# EAGLE schematic schematic (EAGLE 9.5.2)
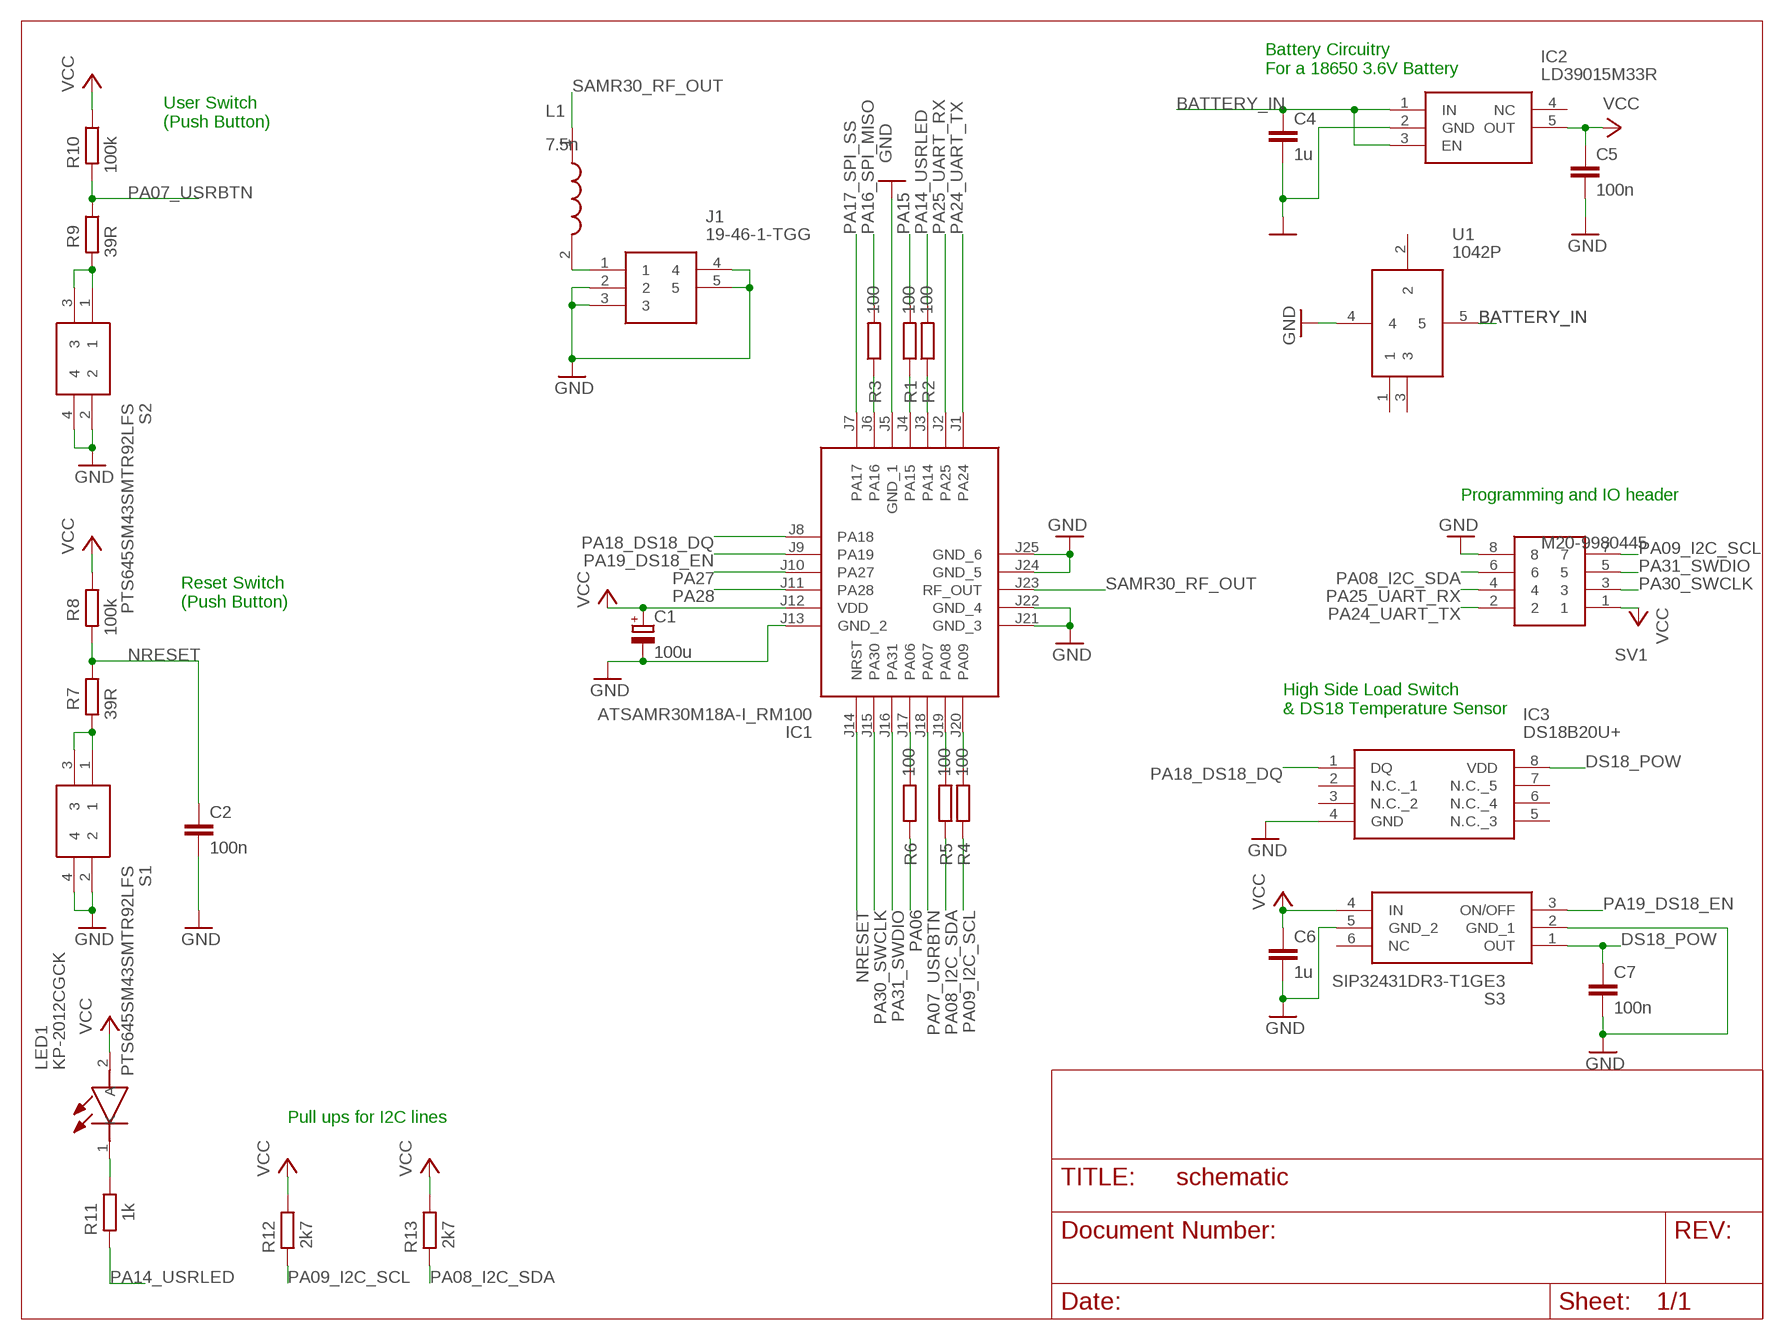
[diagram p0: schematic, sheet 1]

## Parts
C1  100u  CPOL-EUA/3216-18W  [A/3216-18W]
C2  100n  C-EUC0805  [C0805]
C4  1u  C-EUC0805  [C0805]
C5  100n  C-EUC0805  [C0805]
C6  1u  C-EUC0805  [C0805]
C7  100n  C-EUC0805  [C0805]
IC1  ATSAMR30M18A-I_RM100  [ATSAMR30M18AIRM100]
IC2  LD39015M33R  [SOT95P280X145-5N]
IC3  DS18B20U+  [SOP65P490X110-8N]
J1  19-46-1-TGG  [19-46-1-TGG_1]
L1  7.5n  MHQ1005P10NJT  [INDC1006X60N]
LED1  KP-2012CGCK  [LEDC2012X110N]
R1  100  R-EU_R0603  [R0603]
R2  100  R-EU_R0603  [R0603]
R3  100  R-EU_R0603  [R0603]
R4  100  R-EU_R0603  [R0603]
R5  100  R-EU_R0603  [R0603]
R6  100  R-EU_R0603  [R0603]
R7  39R  R-EU_R0603  [R0603]
R8  100k  R-EU_R0603  [R0603]
R9  39R  R-EU_R0603  [R0603]
R10  100k  R-EU_R0603  [R0603]
R11  1k  R-EU_R0603  [R0603]
R12  2k7  R-EU_R0603  [R0603]
R13  2k7  R-EU_R0603  [R0603]
S1  PTS645SM43SMTR92LFS  [PTS645(SMT)]
S2  PTS645SM43SMTR92LFS  [PTS645(SMT)]
S3  SIP32431DR3-T1GE3  [SOT65P210X110-6N]
SV1  M20-9980445  [HDRV8W64P254_2X4_1016X508X868P]
U1  1042P  [1042P]

## Nets
BATTERY_IN: C4.1 IC2.1(IN) IC2.3(EN) U1.5
DS18_POW: C7.1 IC3.8(VDD) S3.1(OUT)
GND: C1.- C2.2 C4.2 C5.2 C6.2 C7.2 IC1.J5(GND_1) IC1.J13(GND_2) IC1.J21(GND_3) IC1.J22(GND_4) IC1.J24(GND_5) IC1.J25(GND_6) IC2.2(GND) IC3.4(GND) J1.2 J1.3 J1.4 J1.5 S1.2 S1.4 S2.2 S2.4 S3.2(GND_1) S3.5(GND_2) SV1.8 U1.4
N$1: R9.2 S2.1 S2.3
N$2: IC1.J4(PA15) R1.1
N$3: IC1.J6(PA16) R3.1
N$4: IC1.J3(PA14) R2.1
N$5: IC1.J17(PA06) R6.2
N$6: IC1.J19(PA08) R5.2
N$7: IC1.J20(PA09) R4.2
N$8: R7.2 S1.1 S1.3
N$9: LED1.1(K) R11.1
N$10: J1.1 L1.2
NRESET: C2.1 IC1.J14(NRST) R7.1 R8.2
PA06: R6.1
PA07_USRBTN: IC1.J18(PA07) R9.1 R10.2
PA08_I2C_SDA: R5.1 R13.2 SV1.6
PA09_I2C_SCL: R4.1 R12.2 SV1.7
PA14_USRLED: R2.2 R11.2
PA15: R1.2
PA16_SPI_MISO: R3.2
PA17_SPI_SS: IC1.J7(PA17)
PA18_DS18_DQ: IC1.J8(PA18) IC3.1(DQ)
PA19_DS18_EN: IC1.J9(PA19) S3.3(ON/OFF)
PA24_UART_TX: IC1.J1(PA24) SV1.2
PA25_UART_RX: IC1.J2(PA25) SV1.4
PA27: IC1.J10(PA27)
PA28: IC1.J11(PA28)
PA30_SWCLK: IC1.J15(PA30) SV1.3
PA31_SWDIO: IC1.J16(PA31) SV1.5
SAMR30_RF_OUT: IC1.J23(RF_OUT) L1.1
VCC: C1.+ C5.1 C6.1 IC1.J12(VDD) IC2.5(OUT) LED1.2(A) R8.1 R10.1 R12.1 R13.1 S3.4(IN) SV1.1
Unconnected: IC2.4(NC) IC3.2(N.C._1) IC3.3(N.C._2) IC3.5(N.C._3) IC3.6(N.C._4) IC3.7(N.C._5) S3.6(NC) U1.1 U1.2 U1.3

## Notes on the sheet
- Battery Circuitry
  For a 18650 3.6V Battery
- User Switch
  (Push Button)
- Programming and IO header
- Reset Switch 
  (Push Button)
- High Side Load Switch
  & DS18 Temperature Sensor
- Pull ups for I2C lines

## Library data of the parts
C1 = rcl:CPOL-EU: POLARIZED CAPACITOR, European symbol; SPICEPREFIX: C
C2 C4-C7 = rcl:C-EU: CAPACITOR, European symbol; SPICEPREFIX: C
IC1 = ATSAMR30M18A-I_RM100:ATSAMR30M18A-I_RM100: Microchip Technology, ATSAMR30M18A-I/RM1 Source: Datasheet <http://www.mouser.com/datasheet/2/268/70005384A-1532404.pdf>; DESCRIPTION: Microchip Technology, ATSAMR30M18A-I/RM1; HEIGHT: 2.1mm; MANUFACTURER_NAME: Microchip; MANUFACTURER_PART_NUMBER: ATSAMR30M18A-I/RM100; MOUSER_PART_NUMBER: 556-AMR30M18AIRM100; MOUSER_PRICE-STOCK: https://www.mouser.com/Search/Refine.aspx?Keyword=556-AMR30M18AIRM100; RS_PART_NUMBER: 1840450; RS_PRICE-STOCK: http://uk.rs-online.com/web/p/products/1840450
IC2 = SamacSys_Parts:LD39015M33R: LD39015M33R, Low Dropout Voltage Regulator, 150mA, 3.3 V +/-2%, 1.5 5.5 Vin, 5-Pin SOT-23 Source: Datasheet <http://www.st.com/web/en/resource/technical/document/datasheet/CD00173477.pdf>; ALLIED_NUMBER: 70521225; ALLIED_PRICE-STOCK: http://www.alliedelec.com/stmicroelectronics-ld39015m33r/70521225/; DESCRIPTION: LD39015M33R, Low Dropout Voltage Regulator, 150mA, 3.3 V +/-2%, 1.5 5.5 Vin, 5-Pin SOT-23; HEIGHT: 1.45mm; MANUFACTURER_NAME: STMicroelectronics; MANUFACTURER_PART_NUMBER: LD39015M33R; MOUSER_PART_NUMBER: 511-LD39015M33R; MOUSER_PRICE-STOCK: https://www.mouser.com/Search/Refine.aspx?Keyword=511-LD39015M33R; RS_PART_NUMBER: 7958965P; RS_PRICE-STOCK: http://uk.rs-online.com/web/p/products/7958965P
IC3 = SamacSys_Parts:DS18B20U+: Board Mount Temperature Sensors Prgmble Resolution 1-Wire Parasite Pwr Source: Datasheet <https://componentsearchengine.com/Datasheets/1/DS18B20U .pdf>; DESCRIPTION: Board Mount Temperature Sensors Prgmble Resolution 1-Wire Parasite Pwr; HEIGHT: 1.1mm; MANUFACTURER_NAME: Maxim Integrated; MANUFACTURER_PART_NUMBER: DS18B20U+; MOUSER_PART_NUMBER: 700-DS18B20U; MOUSER_PRICE-STOCK: https://www.mouser.com/Search/Refine.aspx?Keyword=700-DS18B20U
J1 = SamacSys_Parts:19-46-1-TGG: MULTICOMP - 19-46-1-TGG - RF COAXIAL, SMA, STRAIGHT JACK, 50OHM Source: Datasheet <http://www.farnell.com/datasheets/1661858.pdf>; DESCRIPTION: MULTICOMP - 19-46-1-TGG - RF COAXIAL, SMA, STRAIGHT JACK, 50OHM; HEIGHT: mm; MANUFACTURER_NAME: MULTICOMP; MANUFACTURER_PART_NUMBER: 19-46-1-TGG
L1 = SamacSys_Parts:MHQ1005P10NJT: TDK MHQ1005P Series 10 nH +/-5% Ceramic Multilayer SMD Inductor, 0402 Case, SRF: 4.6GHz Q: 23 500mA dc 190m Rdc Source: Datasheet <https://product.tdk.com/info/en/catalog/datasheets/inductor_commercial_high-frequency_mhq1005p_en.pdf>; DESCRIPTION: TDK MHQ1005P Series 10 nH +/-5% Ceramic Multilayer SMD Inductor, 0402 Case, SRF: 4.6GHz Q: 23 500mA dc 190m Rdc; HEIGHT: 0.6mm; MANUFACTURER_NAME: TDK; MANUFACTURER_PART_NUMBER: MHQ1005P10NJT; MOUSER_PART_NUMBER: 810-MHQ1005P10NJT; MOUSER_PRICE-STOCK: https://www.mouser.com/Search/Refine.aspx?Keyword=810-MHQ1005P10NJT; RS_PART_NUMBER: 7958243P; RS_PRICE-STOCK: http://uk.rs-online.com/web/p/products/7958243P
LED1 = SamacSys_Parts:KP-2012CGCK: Green Chip LED 2.0x1.25mm Kingbright KP-2012CGCK Green LED, 570 nm, 2012 (0805), Rectangle Lens SMD Package Source: Datasheet <https://componentsearchengine.com/Datasheets/2/KP-2012CGCK.pdf>; DESCRIPTION: Green Chip LED 2.0x1.25mm Kingbright KP-2012CGCK Green LED, 570 nm, 2012 (0805), Rectangle Lens SMD Package; HEIGHT: 1.1mm; MANUFACTURER_NAME: Kingbright; MANUFACTURER_PART_NUMBER: KP-2012CGCK; MOUSER_PART_NUMBER: N/A; MOUSER_PRICE-STOCK: https://www.mouser.com/Search/Refine.aspx?Keyword=N%2FA; RS_PART_NUMBER: 8610037P; RS_PRICE-STOCK: http://uk.rs-online.com/web/p/products/8610037P
R1-R13 = rcl:R-EU_: RESISTOR, European symbol; SPICEPREFIX: R
S1 S2 = SamacSys_Parts:PTS645SM43SMTR92LFS: C & K COMPONENTS - PTS645SM43SMTR92LFS - SWITCH, SPST, 0.05A, 12VDC, SMD, 4.3MM Source: Datasheet <https://componentsearchengine.com/Datasheets/1/PTS645SM43SMTR92LFS.pdf>; DESCRIPTION: C & K COMPONENTS - PTS645SM43SMTR92LFS - SWITCH, SPST, 0.05A, 12VDC, SMD, 4.3MM; HEIGHT: mm; MANUFACTURER_NAME: C & K COMPONENTS; MANUFACTURER_PART_NUMBER: PTS645SM43SMTR92LFS; MOUSER_PART_NUMBER: 611-PTS645SM43SMTR92; MOUSER_PRICE-STOCK: https://www.mouser.com/Search/Refine.aspx?Keyword=611-PTS645SM43SMTR92
S3 = SamacSys_Parts:SIP32431DR3-T1GE3: VISHAY - SIP32431DR3-T1GE3 - IC, LOAD SWITCH, 1.1V-5.5V, 1A, SC70 Source: Datasheet <https://www.vishay.com/docs/66597/sip32431.pdf>; DESCRIPTION: VISHAY - SIP32431DR3-T1GE3 - IC, LOAD SWITCH, 1.1V-5.5V, 1A, SC70; HEIGHT: 1.1mm; MANUFACTURER_NAME: Vishay; MANUFACTURER_PART_NUMBER: SIP32431DR3-T1GE3; MOUSER_PART_NUMBER: 781-SIP32431DR3-GE3; MOUSER_PRICE-STOCK: https://www.mouser.com/Search/Refine.aspx?Keyword=781-SIP32431DR3-GE3; RS_PART_NUMBER: 1807353; RS_PRICE-STOCK: http://uk.rs-online.com/web/p/products/1807353
SV1 = SamacSys_Parts:M20-9980445: M20 Header, Pin, Dil, Vertical, 4+4 W HARWIN M20 Series, 2.54mm Pitch 8 Way 2 Row Straight Pin Header, Through Hole, Solder Termination Source: Datasheet <https://componentsearchengine.com/Datasheets/1/M20-9980445.pdf>; ALLIED_NUMBER: R1052696; ALLIED_PRICE-STOCK: https://www.alliedelec.com/harwin-m20-9980445/R1052696/; DESCRIPTION: M20 Header, Pin, Dil, Vertical, 4+4 W HARWIN M20 Series, 2.54mm Pitch 8 Way 2 Row Straight Pin Header, Through Hole, Solder Termination; HEIGHT: 8.68mm; MANUFACTURER_NAME: HARWIN; MANUFACTURER_PART_NUMBER: M20-9980445; MOUSER_PART_NUMBER: 855-M20-9980445; MOUSER_PRICE-STOCK: https://www.mouser.com/Search/Refine.aspx?Keyword=855-M20-9980445; RS_PART_NUMBER: 6812941P; RS_PRICE-STOCK: http://uk.rs-online.com/web/p/products/6812941P
U1 = SamacSys_Parts:1042P: KEYSTONE - 1042P - BATTERY HOLDER, 18650, SMD Source: Datasheet <https://componentsearchengine.com/Datasheets/1/1042P.pdf>; DESCRIPTION: KEYSTONE - 1042P - BATTERY HOLDER, 18650, SMD; HEIGHT: 14mm; MANUFACTURER_NAME: Keystone Electronics; MANUFACTURER_PART_NUMBER: 1042P; MOUSER_PART_NUMBER: 534-1042P; MOUSER_PRICE-STOCK: https://www.mouser.com/Search/Refine.aspx?Keyword=534-1042P